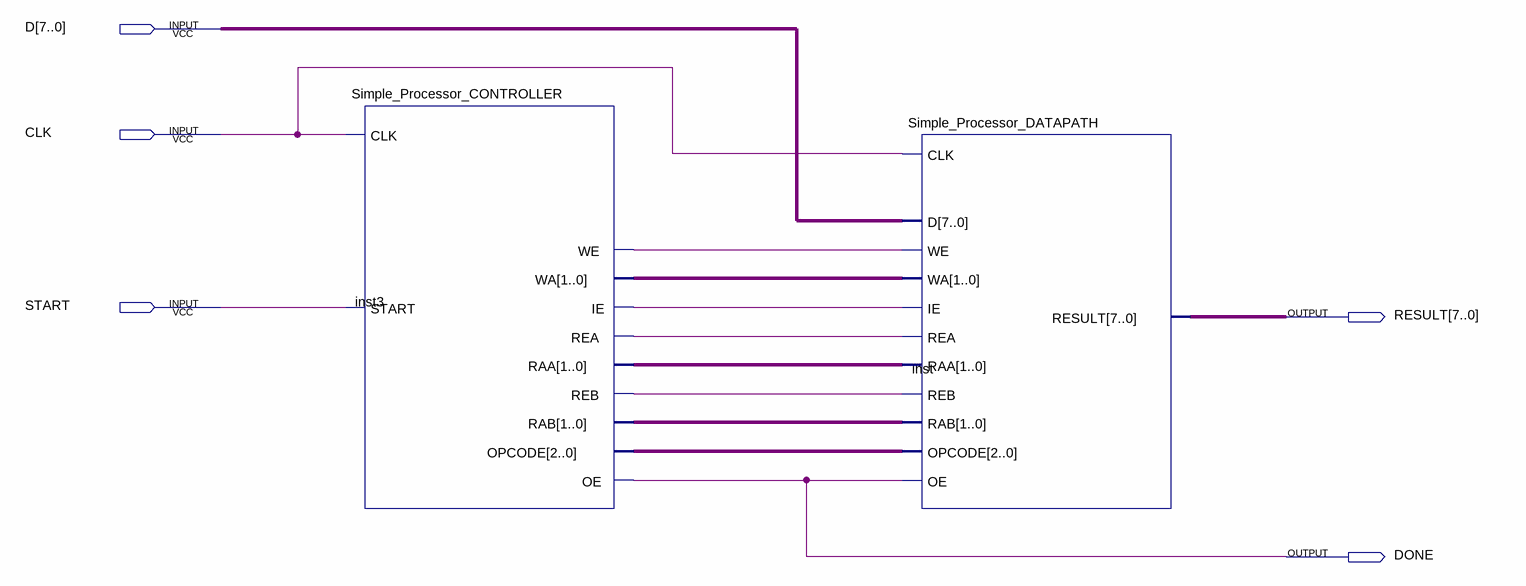
[diagram p0: schematic sheet]
// Quartus schematic Simple_Processor.bdf as structural Verilog: 2 symbols, 5 pins
module Simple_Processor (
  input  [7:0] D,
  input  CLK,
  input  START,
  output [7:0] RESULT,
  output DONE
);

  wire inst3_ie, inst3_rea, inst3_reb, inst3_we;
  wire [1:0] inst3_raa, inst3_rab, inst3_wa;
  wire [2:0] inst3_opcode;

  Simple_Processor_CONTROLLER inst3 (
    .START(START), .CLK(CLK), .WE(inst3_we), .WA(inst3_wa), .IE(inst3_ie), .REA(inst3_rea), .RAA(inst3_raa),
    .REB(inst3_reb), .RAB(inst3_rab), .OPCODE(inst3_opcode), .OE(DONE));
  Simple_Processor_DATAPATH inst (
    .D(D), .IE(inst3_ie), .CLK(CLK), .WA(inst3_wa), .WE(inst3_we), .REA(inst3_rea), .REB(inst3_reb),
    .RAA(inst3_raa), .RAB(inst3_rab), .OPCODE(inst3_opcode), .OE(DONE), .RESULT(RESULT));
endmodule
